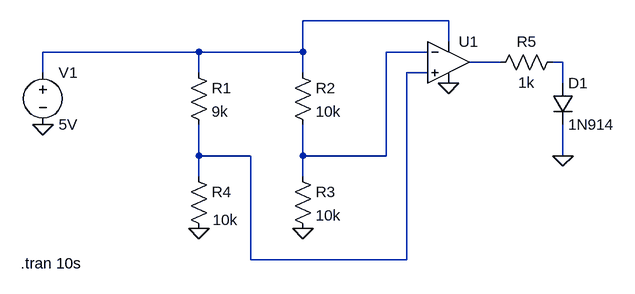
[diagram p0: schematic Clean_ms1.asc]
Clean_ms1.asc, the LTspice schematic file:
Version 4
SHEET 1 880 680
WIRE 432 80 208 80
WIRE 432 112 432 80
WIRE 48 128 -192 128
WIRE 208 128 208 80
WIRE 208 128 48 128
WIRE 400 128 336 128
WIRE 512 144 464 144
WIRE 608 144 592 144
WIRE -192 160 -192 128
WIRE 48 160 48 128
WIRE 208 160 208 128
WIRE 400 160 368 160
WIRE 608 176 608 144
WIRE 48 288 48 240
WIRE 128 288 48 288
WIRE 208 288 208 240
WIRE 336 288 336 128
WIRE 336 288 208 288
WIRE 608 288 608 240
WIRE 48 320 48 288
WIRE 208 320 208 288
WIRE 128 448 128 288
WIRE 368 448 368 160
WIRE 368 448 128 448
FLAG -192 240 0
FLAG 432 176 0
FLAG 48 400 0
FLAG 208 400 0
FLAG 608 288 0
SYMBOL voltage -192 144 R0
WINDOW 123 0 0 Left 0
WINDOW 39 0 0 Left 0
SYMATTR InstName V1
SYMATTR Value 5V
SYMBOL res 32 144 R0
SYMATTR InstName R1
SYMATTR Value 9k
SYMBOL res 192 144 R0
SYMATTR InstName R2
SYMATTR Value 10k
SYMBOL res 192 304 R0
SYMATTR InstName R3
SYMATTR Value 10k
SYMBOL res 32 304 R0
WINDOW 3 37 83 Left 2
SYMATTR Value 10k
SYMATTR InstName R4
SYMBOL res 608 128 R90
WINDOW 0 0 56 VBottom 2
WINDOW 3 32 56 VTop 2
SYMATTR InstName R5
SYMATTR Value 1k
SYMBOL OpAmps\\UniversalOpAmp2 432 144 R0
SYMATTR InstName U1
SYMBOL diode 592 176 R0
SYMATTR InstName D1
SYMATTR Value 1N914
TEXT -226 454 Left 2 !.tran 10s

The netlist it stands for:
* Clean_ms1.asc
V1 N001 0 5V
R1 N001 N005 9k
R2 N001 N002 10k
R3 N002 0 10k
R4 N005 0 10k
R5 N004 N003 1k
XU1 N005 N002 N001 0 N003 level2 Avol=1Meg GBW=10Meg Slew=10Meg Ilimit=25m Rail=0 Vos=0 En=0 Enk=0 In=0 Ink=0 Rin=500Meg  ; pins In+ In- V+ V- OUT
D1 N004 0 1N914
.model D D
.lib standard.dio
.tran 10s
.lib UniversalOpAmp2.lib
.backanno
.end